# EAGLE design ESP32 (EAGLE 7.7.0)
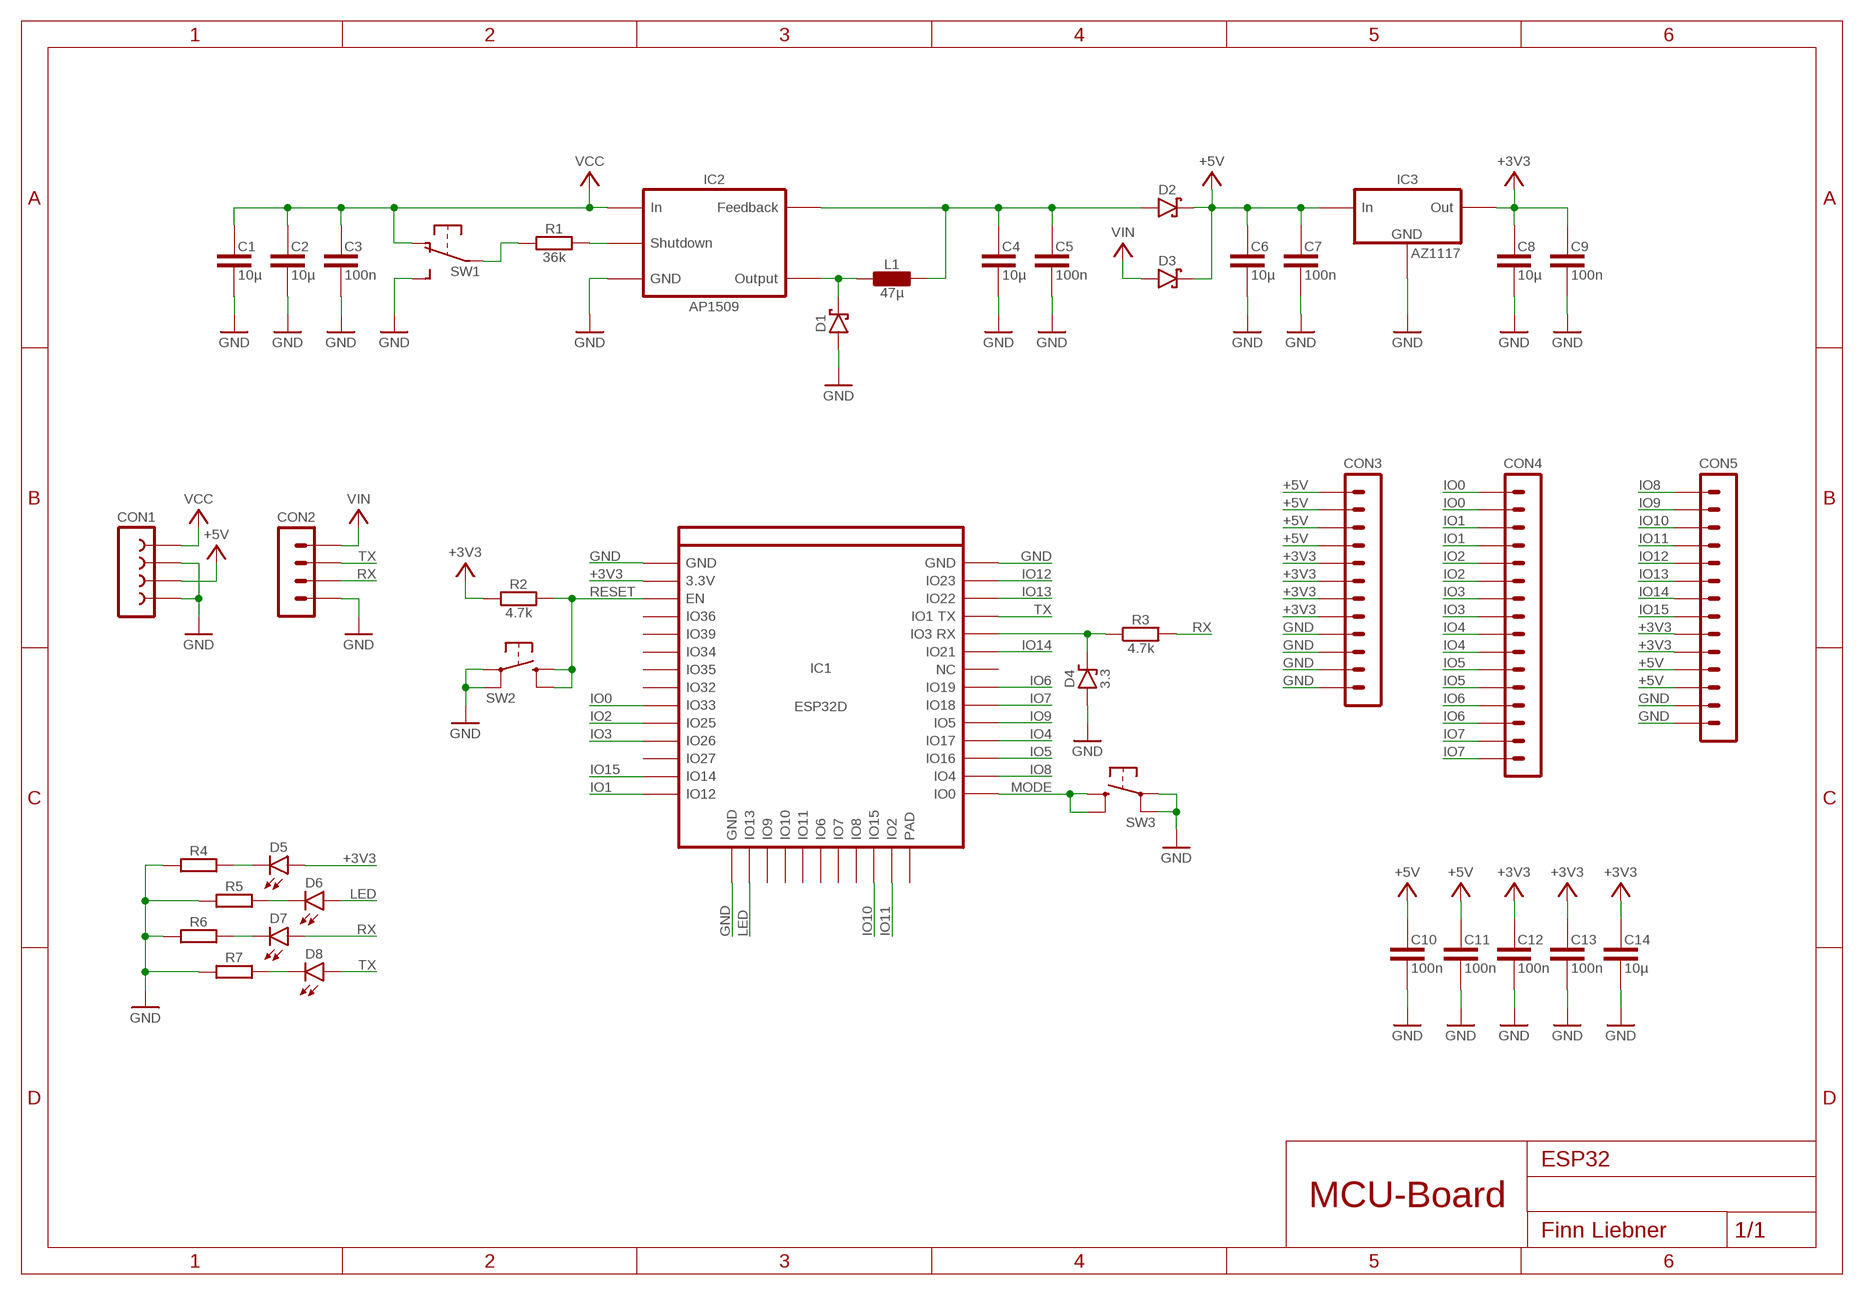
[diagram p0: schematic, sheet 1]

## Parts
C1  10µ  C1210  [C1210]
C2  10µ  C1210  [C1210]
C3  100n  C0805  [C0805]
C4  10µ  C1210  [C1210]
C5  100n  C0805  [C0805]
C6  10µ  C1210  [C1210]
C7  100n  C0805  [C0805]
C8  10µ  C1210  [C1210]
C9  100n  C0805  [C0805]
C10  100n  C0805  [C0805]
C11  100n  C0805  [C0805]
C12  100n  C0805  [C0805]
C13  100n  C0805  [C0805]
C14  10µ  C1210  [C1210]
CON1  CON-4  [CON-4]
CON2  PIN-4  [PIN-4]
D1  D-SCHOTTKY  [DO214AA-2]
D2  D-SCHOTTKY  [DO214AA-2]
D3  D-SCHOTTKY  [DO214AA-2]
D4  3.3  D-ZENER  [SOD123-2]
D5  LED  [D0805]
D6  LED  [D0805]
D7  LED  [D0805]
D8  LED  [D0805]
IC1  ESP32D  ESP32  [ESP32]
IC2  AP1509  [SO8]
IC3  AZ1117  [SOT223]
L1  47µ  L  [L6]
P1  5V  PADSMD  [PAD]
P2  5V  PADSMD  [PAD]
P3  3V  PADSMD  [PAD]
P4  3V  PADSMD  [PAD]
P5  0V  PADSMD  [PAD]
P6  0V  PADSMD  [PAD]
P7  IO0  PADSMD  [PAD]
P8  IO1  PADSMD  [PAD]
P9  IO2  PADSMD  [PAD]
P10  IO3  PADSMD  [PAD]
P11  IO4  PADSMD  [PAD]
P12  IO5  PADSMD  [PAD]
P13  IO6  PADSMD  [PAD]
P14  IO7  PADSMD  [PAD]
P15  5V  PADSMD  [PAD]
P16  5V  PADSMD  [PAD]
P17  3V  PADSMD  [PAD]
P18  3V  PADSMD  [PAD]
P19  0V  PADSMD  [PAD]
P20  0V  PADSMD  [PAD]
P21  IO0  PADSMD  [PAD]
P22  IO1  PADSMD  [PAD]
P23  IO2  PADSMD  [PAD]
P24  IO3  PADSMD  [PAD]
P25  IO4  PADSMD  [PAD]
P26  IO5  PADSMD  [PAD]
P27  IO6  PADSMD  [PAD]
P28  IO7  PADSMD  [PAD]
P30  IO8  PADTH  [PAD2]
P31  IO9  PADTH  [PAD2]
P32  IO10  PADTH  [PAD2]
P33  IO11  PADTH  [PAD2]
P34  IO12  PADTH  [PAD2]
P35  IO13  PADTH  [PAD2]
P39  5V  PADTH  [PAD2]
P40  3V  PADTH  [PAD2]
P41  0V  PADTH  [PAD2]
P42  IO14  PADTH  [PAD2]
P43  IO15  PADTH  [PAD2]
P44  3V  PADTH  [PAD2]
P45  5V  PADTH  [PAD2]
P46  0V  PADTH  [PAD2]
R1  36k  R  [R0805]
R2  4.7k  R  [R0805]
R3  4.7k  R  [R0805]
R4  R  [R0805]
R5  R  [R0805]
R6  R  [R0805]
R7  R  [R0805]
SW1  SW1  [SW1]
SW2  SW2  [SW2]
SW3  SW2  [SW2]

## Nets
+3V3: C8.1 C9.1 C12.1 C13.1 C14.1 D5.A IC1.2(3.3V) IC3.2(OUT) IC3.4(OUT) P3.1 P4.1 P17.1 P18.1 P40.P$1 P44.P$1 R2.1
+5V: C6.1 C7.1 C10.1 C11.1 CON1.3 D2.K(C) D3.K(C) IC3.3(VCC) P1.1 P2.1 P15.1 P16.1 P39.P$1 P45.P$1
GND: C1.2 C2.2 C3.2 C4.2 C5.2 C6.2 C7.2 C8.2 C9.2 C10.2 C11.2 C12.2 C13.2 C14.2 CON1.2 CON1.4 CON2.4 D1.A D4.A IC1.1(GND0) IC1.15(GND1) IC1.38(GND2) IC2.5(GND) IC2.6(GND) IC2.7(GND) IC2.8(GND) IC3.1(GND) P5.1 P6.1 P19.1 P20.1 P41.P$1 P46.P$1 R4.2 R5.2 R6.2 R7.2 SW1.3 SW1.6 SW2.1(P0) SW2.3(P1) SW3.1(P0) SW3.3(P1)
IO0: IC1.9(IO33) P7.1 P21.1
IO1: IC1.14(IO12) P8.1 P22.1
IO2: IC1.10(IO25) P9.1 P23.1
IO3: IC1.11(IO26) P10.1 P24.1
IO4: IC1.28(IO17) P11.1 P25.1
IO5: IC1.27(IO16) P12.1 P26.1
IO6: IC1.31(IO19) P13.1 P27.1
IO7: IC1.30(IO18) P14.1 P28.1
IO8: IC1.26(IO4) P30.P$1
IO9: IC1.29(IO5) P31.P$1
IO10: IC1.23(IO15) P32.P$1
IO11: IC1.24(IO2) P33.P$1
IO12: IC1.37(IO23) P34.P$1
IO13: IC1.36(IO22) P35.P$1
IO14: IC1.33(IO21) P42.P$1
IO15: IC1.13(IO14) P43.P$1
LED: D6.A IC1.16(IO13)
MODE: IC1.25(IO0) SW3.2(S0) SW3.4(S1)
N$1: IC2.4(SHDN) R1.2
N$2: D1.K(C) IC2.2(OUT) L1.1
N$3: R1.1 SW1.2(C) SW1.5(C)
N$4: C4.1 C5.1 D2.A IC2.3(FB) L1.2
N$5: D5.K R4.1
N$6: D4.K(C) IC1.34(IO3) R3.1
N$7: D6.K R5.1
N$8: D7.K R6.1
N$9: D8.K R7.1
RESET: IC1.3(EN) R2.2 SW2.2(S0) SW2.4(S1)
RX: CON2.3 D7.A R3.2
TX: CON2.2 D8.A IC1.35(IO1)
VCC: C1.1 C2.1 C3.1 CON1.1 IC2.1(IN) SW1.1 SW1.4
VIN: CON2.1 D3.A
Unconnected: IC1.4(IO36) IC1.5(IO39) IC1.6(IO34) IC1.7(IO35) IC1.8(IO32) IC1.12(IO27) IC1.17(IO9) IC1.18(IO10) IC1.19(IO11) IC1.20(IO6) IC1.21(IO7) IC1.22(IO8) IC1.32(NC) IC1.39_1(GND3) IC1.39_2(GND3) IC1.39_3(GND3) IC1.39_4(GND3) IC1.39_5(GND3) IC1.39_6(GND3) IC1.39_7(GND3) IC1.39_8(GND3) IC1.39_9(GND3)

## Notes on the sheet
- CON3 | CON4 | CON5

## Library data of the parts
C1-C14 = ESP-Board:C
CON1 = ESP-Board:CON-4
CON2 = ESP-Board:PIN-4
D1-D3 = ESP-Board:D-SCHOTTKY
D4 = ESP-Board:D-ZENER
D5-D8 = ESP-Board:LED
IC1 = ESP-Board:ESP32
IC2 = ESP-Board:AP1509
IC3 = ESP-Board:AZ1117
L1 = ESP-Board:L
P1-P28 P30-P35 P39-P46 = ESP-Board:PAD
R1-R7 = ESP-Board:R
SW1 = ESP-Board:SW1
SW2 SW3 = ESP-Board:SW2

## Board
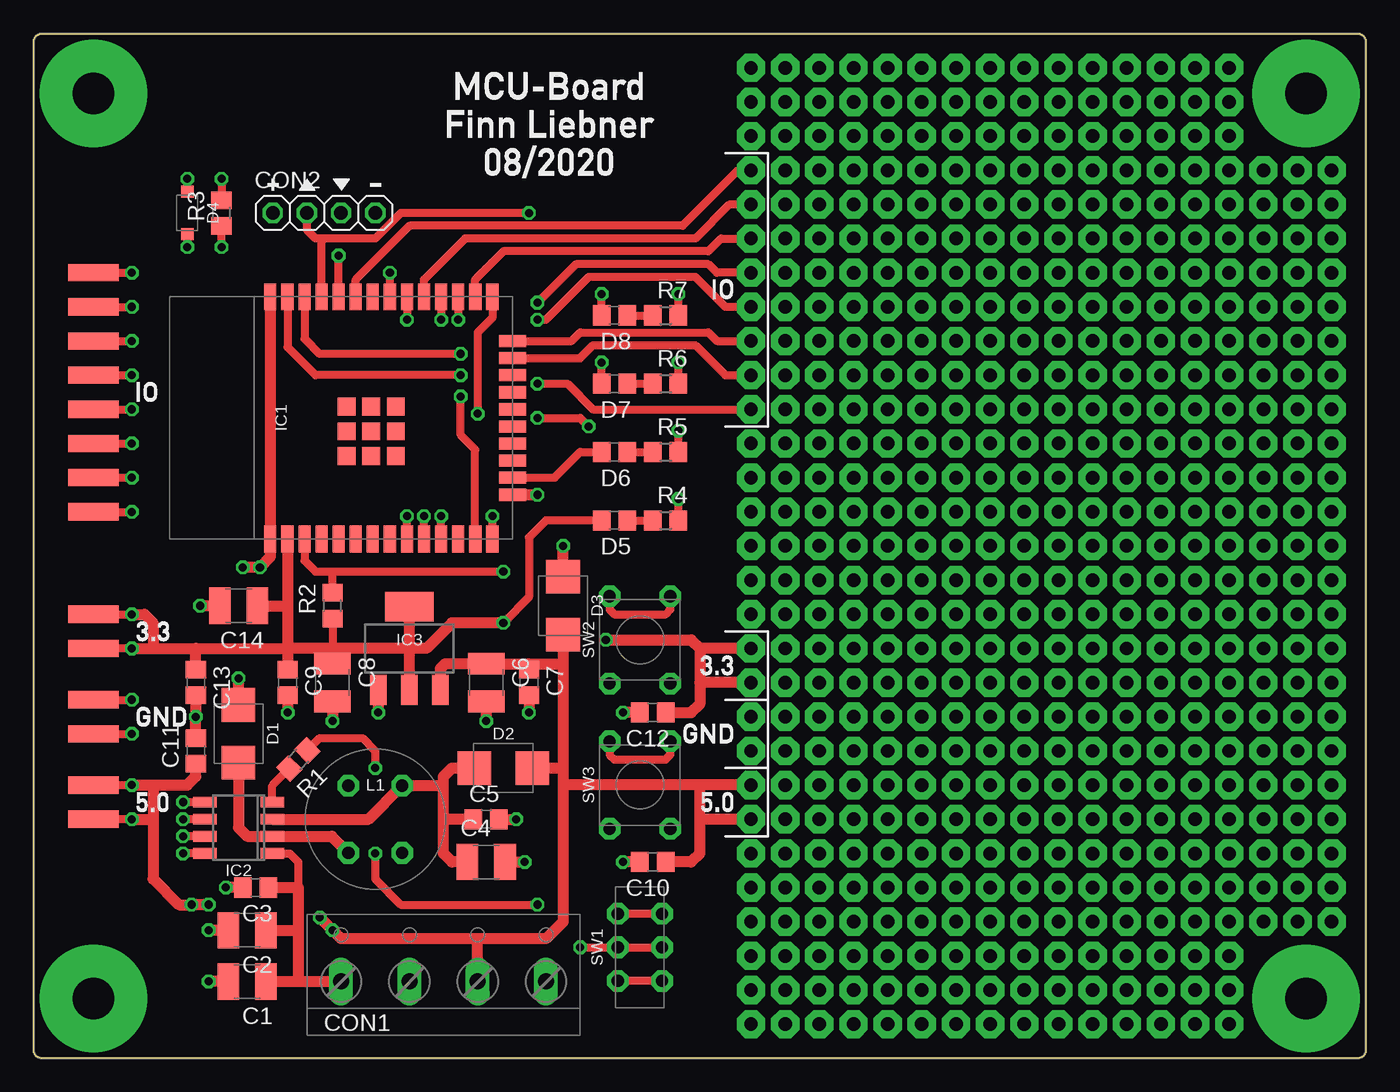
[diagram p1: board, top side]
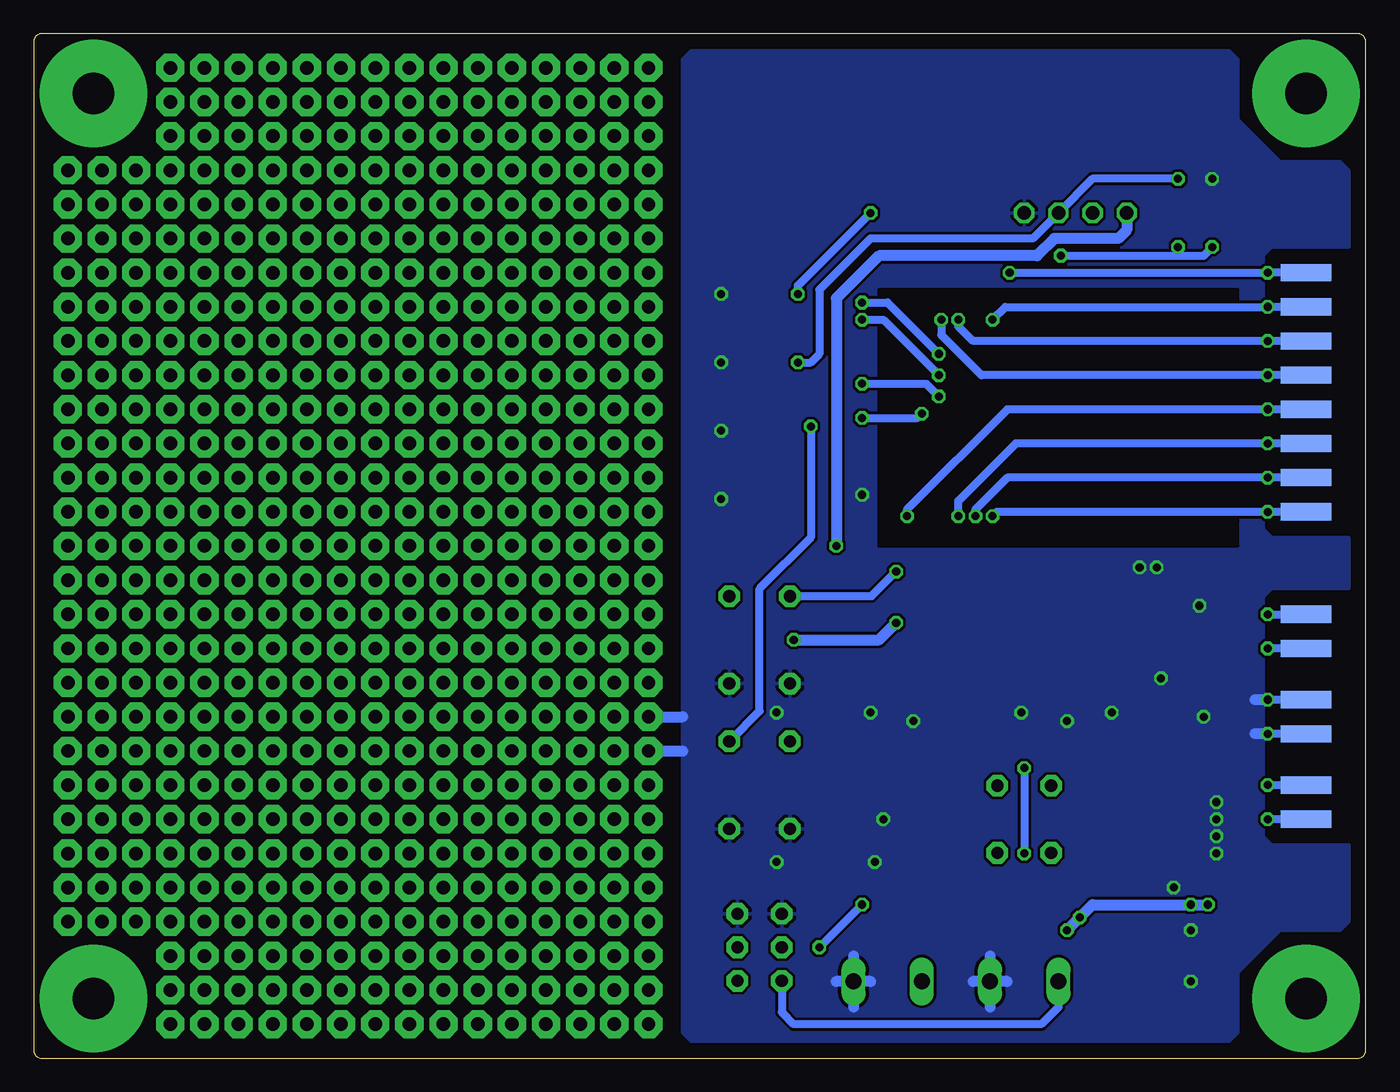
[diagram p2: board, bottom side, seen from below]

Size 99.06 x 76.2 mm. Coordinates in mm from the lower left corner, seen from the top.
Outline: 99.06,75.56 99.06,0.64 arc-90 98.42,0 0.64,0 arc-90 0,0.64 0,75.56 arc-90 0.64,76.2 98.42,76.2 arc-90 99.06,75.56
Copper layers (1*16): Top 0.035mm / dielectric 1.5mm / Bottom 0.035mm
Design rules "default": minimum track width 10mil, minimum drill 24mil, track to track 8mil, track to pad 8mil, pad to pad 8mil, via to via 8mil, smd to smd 8mil, copper to edge 40mil, drill to drill 8mil, minimum pad ring 10mil, minimum via ring 8mil, stop-mask expansion 4mil, vias tented up to drill 0mil, thermal gap 10mil

### Footprints (pad centres in the part's own frame; a part is rotated, then mirrored left to right if it is on the bottom)
C1210 = smd 1.6 x 2.7: 1 -1.4,0; 2 1.4,0
C0805 = smd 1.3 x 1.5: 1 -0.95,0; 2 0.95,0
CON-4 = drill 1.194 long: 1 -7.62,0; 2 -2.54,0; 3 2.54,0; 4 7.62,0
PIN-4 = drill 1 octagon: 1 -3.81,0; 2 -1.27,0; 3 1.27,0; 4 3.81,0
DO214AA-2 = smd 2.5 x 2.5: A -2.15,0; K 2.15,0
SOD123-2 = smd 0.9 x 0.95: A -1.575,0; K 1.575,0
D0805 = smd 1.3 x 1.5: A 0.95,0; K -0.95,0
ESP32 = smd 2 x 0.9: 1 -9,7.8; 2 -9,6.53; 3 -9,5.26; 4 -9,3.99; 5 -9,2.72; 6 -9,1.45; 7 -9,0.18; 8 -9,-1.09; 9 -9,-2.36; 10 -9,-3.63; 11 -9,-4.9; 12 -9,-6.17; 13 -9,-7.44; 14 -9,-8.71; 25 9,-8.71; 26 9,-7.44; 27 9,-6.17; 28 9,-4.9; 29 9,-3.63; 30 9,-2.36; 31 9,-1.09; 32 9,0.18; 33 9,1.45; 34 9,2.72; 35 9,3.99; 36 9,5.26; 37 9,6.53; 38 9,7.8 | smd 0.9 x 2: 15 -5.715,-10.21; 16 -4.445,-10.21; 17 -3.175,-10.21; 18 -1.905,-10.21; 19 -0.635,-10.21; 20 0.635,-10.21; 21 1.905,-10.21; 22 3.175,-10.21; 23 4.445,-10.21; 24 5.715,-10.21 | smd 1.33 x 1.33: 39_1 -2.835,2.135; 39_2 -1,2.135; 39_3 0.835,2.135; 39_4 -2.835,0.3; 39_5 -1,0.3; 39_6 0.835,0.3; 39_7 -2.835,-1.535; 39_8 -1,-1.535; 39_9 0.835,-1.535
SO8 = smd 1.75 x 0.8: 1 -2.5,1.905; 2 -2.5,0.635; 3 -2.5,-0.635; 4 -2.5,-1.905; 5 2.5,-1.905; 6 2.5,-0.635; 7 2.5,0.635; 8 2.5,1.905
SOT223 = smd 1.219 x 2.235: 1 -2.311,-3.099; 2 0,-3.099; 3 2.311,-3.099 | smd 3.6 x 2.2: 4 0,3.099
L6 = drill 0.9 pad 1.6 octagon: 1 -2,-2.5; 2 2,2.5; 3 -2,2.5; 4 2,-2.5
PAD = smd 1.27 x 3.81: 1 0,0
PAD2 = drill 1 pad 2.1 octagon: P$1 0,0
R0805 = smd 1.3 x 1.5: 1 -0.95,0; 2 0.95,0
SW1 = drill 0.9 pad 1.6 octagon: 1 -2.5,-1.65; 2 0,-1.65; 3 2.5,-1.65; 4 -2.5,1.65; 5 0,1.65; 6 2.5,1.65
SW2 = drill 0.9 pad 1.6 octagon: 1 -3.25,2.25; 2 3.25,2.25; 3 -3.25,-2.25; 4 3.25,-2.25

### Placement (x,y rotation side)
C1  15.88,5.71 180 top
C2  15.88,9.53 180 top
C3  16.51,12.7 180 top
C4  33.66,14.61 0 top
C5  33.66,17.78 0 top
C6  33.66,27.94 270 top
C7  36.83,27.94 270 top
C8  22.23,27.94 270 top
C9  18.89,27.94 270 top
C10  46.04,14.61 180 top
C11  12.06,22.86 90 top
C12  46.04,25.72 180 top
C13  12.06,27.94 270 top
C14  15.24,33.66 180 top
CON1  30.48,5.71 0 top
CON2  21.59,62.87 0 top
D1  15.24,24.13 270 top
D2  34.92,21.59 0 top
D3  39.37,33.66 270 top
D4  11.43,62.87 270 top
D5  43.18,40.01 180 top
D6  43.18,45.09 180 top
D7  43.18,50.16 180 top
D8  43.18,55.24 180 top
IC1  25.4,47.62 90 top
IC2  15.24,17.14 180 top
IC3  27.94,30.48 0 top
L1  25.4,17.78 0 top
P1  4.45,20.32 90 top
P2  4.45,17.78 90 top
P3  4.45,30.48 90 top
P4  4.45,33.02 90 top
P5  4.45,24.13 90 top
P6  4.45,26.67 90 top
P7  4.45,40.64 90 top
P8  4.45,48.26 90 top
P9  4.45,43.18 90 top
P10  4.45,45.72 90 top
P11  4.45,53.34 90 top
P12  4.45,50.8 90 top
P13  4.45,58.42 90 top
P14  4.45,55.88 90 top
P15  4.45,20.32 270 bottom
P16  4.45,17.78 270 bottom
P17  4.45,33.02 270 bottom
P18  4.45,30.48 270 bottom
P19  4.45,26.67 270 bottom
P20  4.45,24.13 270 bottom
P21  4.45,40.64 270 bottom
P22  4.45,48.26 270 bottom
P23  4.45,43.18 270 bottom
P24  4.45,45.72 270 bottom
P25  4.45,53.34 270 bottom
P26  4.45,50.8 270 bottom
P27  4.45,58.42 270 bottom
P28  4.45,55.88 270 bottom
P30  53.34,60.96 90 top
P31  53.34,63.5 90 top
P32  53.34,50.8 90 top
P33  53.34,53.34 90 top
P34  53.34,55.88 90 top
P35  53.34,58.42 90 top
P39  53.34,20.32 180 top
P40  53.34,27.94 180 top
P41  53.34,25.4 180 top
P42  53.34,66.04 270 top
P43  53.34,48.26 270 top
P44  53.34,30.48 0 top
P45  53.34,17.78 0 top
P46  53.34,22.86 0 top
R1  19.68,22.23 225 top
R2  22.23,33.66 90 top
R3  13.97,62.87 90 top
R4  46.99,40.01 0 top
R5  46.99,45.09 0 top
R6  46.99,50.16 0 top
R7  46.99,55.24 0 top
SW1  45.09,8.26 90 top
SW2  45.09,31.11 90 top
SW3  45.09,20.32 90 top

### Tracks (layer width: path | path; a pad name or v marks a point on that pad's centre or on a via)
+3V3  (via drill 0.6)
  Top 0.61: P17.1 v7.3,33.02 | v7.3,30.48 P18.1 | R2.1 22.23,30.48 | D5.A 38.1,40.01 36.83,38.73 36.83,34.29 v34.92,32.38
  Top 0.813: 27.94,30.48 22.23,30.48 | C8.1 22.23,30.48 | IC3.2 27.94,30.48 | 27.94,30.48 IC3.4 | IC1.2 18.87,33.66 | 18.87,33.66 18.87,30.48 | 18.87,30.48 18.87,28.91 C9.1 | v7.3,30.48 8.89,30.48 | 8.89,30.48 8.89,32.38 8.26,33.02 v7.3,33.02 | v34.92,32.38 31.11,32.38 29.21,30.48 27.94,30.48 | C12.1 48.9,25.72 49.53,26.35 49.53,27.94 | v42.55,31.11 48.9,31.11 49.53,30.48 | 49.53,30.48 49.53,27.94 | P44.P$1 49.53,30.48 | P40.P$1 49.53,27.94 | 22.23,30.48 18.87,30.48 | 8.89,30.48 12.06,30.48 | 12.06,30.48 18.87,30.48 | C13.1 12.06,30.48 | C14.1 18.87,33.66
  Bottom 0.61: v7.3,33.02 P17.1 | P18.1 v7.3,30.48
  Bottom 0.813: v42.55,31.11 36.2,31.11 v34.92,32.38
+5V  (via drill 0.6)
  Top 0.61: P15.1 v7.3,20.32 | v7.3,17.78 P16.1
  Top 0.813: v7.3,17.78 8.89,17.78 | C10.1 48.9,14.61 49.53,15.24 49.53,17.78 | IC3.3 30.25,28.98 30.61,29.34 C6.1 36.83,29.34 | C7.1 36.83,29.34 | CON1.3 33.02,8.89 | v21.27,10.48 v22.23,9.53 22.86,8.89 33.02,8.89 | v13.02,11.43 v11.75,11.43 10.79,11.43 8.89,13.34 8.89,17.78 | 8.89,20.32 8.89,17.78 | v7.3,20.32 8.89,20.32 | 8.89,20.32 11.43,20.32 12.06,20.95 C11.1 | D3.K 39.37,29.21 | 39.37,29.21 39.37,21.59 | 39.37,21.59 39.37,20.32 | 39.37,20.32 39.37,10.16 38.1,8.89 33.02,8.89 | D2.K 39.37,21.59 | 36.83,29.34 39.24,29.34 39.37,29.21 | P39.P$1 49.53,20.32 | 49.53,20.32 39.37,20.32 | 49.53,17.78 49.53,20.32 | P45.P$1 49.53,17.78
  Bottom 0.61: v7.3,20.32 P15.1 | P16.1 v7.3,17.78
  Bottom 0.813: v11.75,11.43 v13.02,11.43 20.32,11.43 v21.27,10.48 v22.23,9.53
GND  (via drill 0.6)
  Top 0.61: IC2.8 v11.11,15.24 | IC2.7 v11.11,16.51 | IC2.6 v11.11,17.78 | IC2.5 v11.11,19.05 | SW1.3 SW1.6 | P19.1 v7.3,26.67 | P20.1 v7.3,24.13 | R4.2 v47.94,41.59 | R5.2 v47.94,46.67 | R6.2 v47.94,51.75 | R7.2 v47.94,56.83 | D4.A v11.43,65.41
  Top 0.813: C1.2 v13.02,5.71 | C2.2 v13.02,9.53 | C3.2 v14.29,12.7 | IC3.1 v25.63,25.72 | C8.2 v22.23,25.08 | C6.2 v33.66,25.08 | C7.2 v36.83,25.72 | D1.A v15.24,28.26 | IC1.38 IC1.1 17.6,37.28 v16.83,36.51 v15.56,36.51 | IC1.15 v37.47,41.91 | C10.2 v43.81,14.61 | C12.2 v43.81,25.72 | C4.2 v36.51,14.61 | C5.2 v35.88,17.78 | C11.2 v12.06,25.4 C13.2 | C9.2 v18.89,25.72 | C14.2 v12.38,33.66
  Bottom 0.61: P19.1 v7.3,26.67 | P20.1 v7.3,24.13
  Bottom 0.813: v7.3,24.13 8.26,24.13 | v7.3,26.67 8.26,26.67 | P46.P$1 50.8,22.86 | P41.P$1 50.8,25.4 | 26.67,5.71 29.21,5.71 | 27.94,7.62 27.94,3.81 | 38.1,7.62 38.1,3.81 | 36.83,5.71 39.37,5.71
  pour Bottom: 1.91,9.53 6.35,9.53 9.53,6.35 9.53,1.91 10.16,1.27 50.16,1.27 50.8,1.91 50.8,74.3 50.16,74.93 10.16,74.93 9.53,74.3 9.53,69.85 6.35,66.67 1.91,66.67 1.27,66.04 1.27,60.33 6.99,60.33 7.62,59.69 7.62,39.37 6.99,38.73 1.27,38.73 1.27,34.92 6.99,34.92 7.62,34.29 7.62,16.51 6.99,15.88 1.27,15.88 1.27,10.16
IO0  (via drill 0.6)
  Top 0.61: IC1.9 v27.76,40.32 | P21.1 v7.3,40.64
  Bottom 0.61: v27.76,40.32 27.44,40.64 v7.3,40.64 P21.1
IO1  (via drill 0.6)
  Top 0.61: IC1.14 v34.11,40.32 | P22.1 v7.3,48.26
  Bottom 0.61: v34.11,40.32 34.11,40.82 26.67,48.26 v7.3,48.26 P22.1
IO2  (via drill 0.6)
  Top 0.61: IC1.10 v29.03,40.32 | P23.1 v7.3,43.18
  Bottom 0.61: v29.03,40.32 29.03,40.82 26.67,43.18 v7.3,43.18 P23.1
IO3  (via drill 0.6)
  Top 0.61: IC1.11 v30.3,40.32 | P24.1 v7.3,45.72
  Bottom 0.61: v30.3,40.32 30.3,41.45 26.04,45.72 v7.3,45.72 P24.1
IO4  (via drill 0.6)
  Top 0.61: P25.1 v7.3,53.34 | IC1.28 v30.3,54.93
  Bottom 0.61: v30.3,54.93 30.3,54.43 29.21,53.34 v7.3,53.34 P25.1
IO5  (via drill 0.6)
  Top 0.61: P26.1 v7.3,50.8 | IC1.27 v31.57,54.93
  Bottom 0.61: v31.57,54.93 31.57,53.8 28.57,50.8 v7.3,50.8 P26.1
IO6  (via drill 0.6)
  Top 0.61: P27.1 v7.3,58.42 | IC1.31 v26.49,58.42
  Bottom 0.61: v26.49,58.42 v7.3,58.42 P27.1
IO7  (via drill 0.6)
  Top 0.61: P28.1 v7.3,55.88 | IC1.30 v27.76,54.93
  Bottom 0.61: v27.76,54.93 26.81,55.88 v7.3,55.88 P28.1
IO8
  Top 0.61: P30.P$1 51.12,60.96 50.16,60.01 34.92,60.01 32.84,57.92 IC1.26
IO9
  Top 0.61: P31.P$1 51.75,63.5 49.21,60.96 32.07,60.96 29.03,57.92 IC1.29
IO10
  Top 0.61: IC1.23 40.64,52.07 41.59,53.02 49.21,53.02 51.44,50.8 P32.P$1
IO11
  Top 0.61: IC1.24 40.01,53.34 40.64,53.98 50.16,53.98 50.8,53.34 P33.P$1
IO12  (via drill 0.6)
  Top 0.61: P34.P$1 51.44,55.88 49.21,58.1 41.27,58.1 38.1,54.93 v37.47,54.93 | v31.75,50.8 20.95,50.8 18.87,52.88 IC1.37
  Bottom 0.61: v37.47,54.93 35.88,54.93 v31.75,50.8
IO13  (via drill 0.6)
  Top 0.61: P35.P$1 50.8,58.42 50.16,59.05 40.32,59.05 v37.47,56.2 | v31.75,52.39 21.27,52.39 20.14,53.52 IC1.36
  Bottom 0.61: v37.47,56.2 35.56,56.2 v31.75,52.39
IO14
  Top 0.61: P42.P$1 52.39,66.04 48.26,61.91 27.94,61.91 23.95,57.92 IC1.33
IO15  (via drill 0.6)
  Top 0.61: IC1.13 32.84,45.27 31.75,46.35 v31.75,49.21 | v37.47,50.16 39.69,50.16 41.59,48.26 P43.P$1
  Bottom 0.61: v37.47,50.16 32.7,50.16 v31.75,49.21
LED
  Top 0.61: IC1.16 38.73,43.18 40.64,45.09 D6.A
MODE  (via drill 0.6)
  Top 0.61: SW3.4 47.34,22.57 46.99,22.23 43.18,22.23 42.84,22.57 SW3.2 | IC1.25 34.11,55.06 33.02,53.98 v33.02,47.94 | v37.47,47.62 40.64,47.62 v41.27,46.99
  Bottom 0.61: SW3.4 45.09,25.82 45.09,34.92 41.27,38.73 v41.27,46.99 | v37.47,47.62 33.34,47.62 v33.02,47.94
N$1
  Top 0.61: R1.2 17.74,20.28 IC2.4
N$2
  Top 0.813: D1.K 15.24,17.14 15.88,16.51 IC2.2 22.17,16.51 L1.1
N$3  (via drill 0.6)
  Top 0.61: SW1.2 SW1.5 v40.64,8.26 | v25.4,21.59 25.4,22.86 24.45,23.81 21.27,23.81 R1.1 | v25.4,15.24 25.4,13.34 27.3,11.43 v37.47,11.43
  Bottom 0.61: v25.4,21.59 v25.4,15.24 | v37.47,11.43 v40.64,8.26
N$4
  Top 0.813: IC2.3 24.9,17.78 L1.2 30.44,20.28 30.48,20.32 | C4.1 31.11,14.61 30.48,15.24 30.48,17.78 | 30.48,17.78 30.48,20.32 | 30.48,20.32 30.48,20.95 31.11,21.59 D2.A | C5.1 30.48,17.78
N$5
  Top 0.61: D5.K R4.1
N$6  (via drill 0.6)
  Top 0.61: IC1.34 v22.68,59.69 | v13.97,60.33 R3.1 | D4.K v11.43,60.33
  Bottom 0.61: v22.68,59.69 13.97,59.69 | 13.97,59.69 12.06,59.69 v11.43,60.33 | v13.97,60.33 13.97,59.69
N$7
  Top 0.61: D6.K R5.1
N$8
  Top 0.61: D7.K R6.1
N$9
  Top 0.61: D8.K R7.1
N$10  (via drill 1 pad 2.1)
  other vias: 53.34,40.64
N$11  (via drill 3.1 pad 8)
  other vias: 4.45,4.45
N$12  (via drill 1 pad 2.1)
  other vias: 53.34,43.18
N$13  (via drill 1 pad 2.1)
  other vias: 53.34,45.72
N$14  (via drill 1 pad 2.1)
  other vias: 53.34,71.12
N$15  (via drill 1 pad 2.1)
  other vias: 53.34,68.58
N$16  (via drill 1 pad 2.1)
  other vias: 53.34,73.66
N$25  (via drill 1 pad 2.1)
  other vias: 53.34,12.7
N$26  (via drill 1 pad 2.1)
  other vias: 53.34,15.24
N$27  (via drill 1 pad 2.1)
  other vias: 53.34,33.02
N$28  (via drill 1 pad 2.1)
  other vias: 53.34,38.1
N$29  (via drill 1 pad 2.1)
  other vias: 53.34,35.56
N$30  (via drill 1 pad 2.1)
  other vias: 53.34,10.16
N$31  (via drill 1 pad 2.1)
  other vias: 53.34,5.08
N$32  (via drill 1 pad 2.1)
  other vias: 53.34,7.62
N$33  (via drill 1 pad 2.1)
  other vias: 53.34,2.54
N$73  (via drill 3.1 pad 8)
  other vias: 94.61,71.75
N$225  (via drill 3.1 pad 8)
  other vias: 94.61,4.45
N$249  (via drill 3.1 pad 8)
  other vias: 4.45,4.45
N$252  (via drill 3.1 pad 8)
  other vias: 4.45,71.75
N$404
  cutout Bottom: 9.53,38.1 36.2,38.1 36.2,57.15 9.53,57.15
N$1056  (via drill 1 pad 2.1)
  other vias: 58.42,12.7
N$1057  (via drill 1 pad 2.1)
  other vias: 55.88,12.7
N$1059  (via drill 1 pad 2.1)
  other vias: 58.42,15.24
N$1060  (via drill 1 pad 2.1)
  other vias: 55.88,15.24
N$1062  (via drill 1 pad 2.1)
  other vias: 58.42,17.78
N$1063  (via drill 1 pad 2.1)
  other vias: 55.88,17.78
N$1065  (via drill 1 pad 2.1)
  other vias: 58.42,20.32
N$1066  (via drill 1 pad 2.1)
  other vias: 55.88,20.32
N$1067  (via drill 1 pad 2.1)
  other vias: 58.42,22.86
N$1068  (via drill 1 pad 2.1)
  other vias: 55.88,22.86
N$1069  (via drill 1 pad 2.1)
  other vias: 58.42,25.4
N$1070  (via drill 1 pad 2.1)
  other vias: 55.88,25.4
N$1071  (via drill 1 pad 2.1)
  other vias: 58.42,27.94
N$1072  (via drill 1 pad 2.1)
  other vias: 55.88,27.94
N$1073  (via drill 1 pad 2.1)
  other vias: 58.42,30.48
N$1074  (via drill 1 pad 2.1)
  other vias: 55.88,30.48
N$1075  (via drill 1 pad 2.1)
  other vias: 58.42,33.02
N$1076  (via drill 1 pad 2.1)
  other vias: 55.88,33.02
N$1077  (via drill 1 pad 2.1)
  other vias: 58.42,35.56
N$1078  (via drill 1 pad 2.1)
  other vias: 55.88,35.56
N$1079  (via drill 1 pad 2.1)
  other vias: 58.42,38.1
N$1080  (via drill 1 pad 2.1)
  other vias: 55.88,38.1
N$1081  (via drill 1 pad 2.1)
  other vias: 58.42,40.64
N$1082  (via drill 1 pad 2.1)
  other vias: 55.88,40.64
N$1083  (via drill 1 pad 2.1)
  other vias: 58.42,43.18
N$1084  (via drill 1 pad 2.1)
  other vias: 55.88,43.18
N$1085  (via drill 1 pad 2.1)
  other vias: 58.42,45.72
N$1086  (via drill 1 pad 2.1)
  other vias: 55.88,45.72
N$1088  (via drill 1 pad 2.1)
  other vias: 58.42,48.26
N$1089  (via drill 1 pad 2.1)
  other vias: 55.88,48.26
N$1096  (via drill 1 pad 2.1)
  other vias: 58.42,50.8
N$1097  (via drill 1 pad 2.1)
  other vias: 55.88,50.8
N$1100  (via drill 1 pad 2.1)
  other vias: 58.42,53.34
N$1101  (via drill 1 pad 2.1)
  other vias: 55.88,53.34
N$1104  (via drill 1 pad 2.1)
  other vias: 58.42,55.88
N$1105  (via drill 1 pad 2.1)
  other vias: 55.88,55.88
N$1108  (via drill 1 pad 2.1)
  other vias: 58.42,58.42
N$1109  (via drill 1 pad 2.1)
  other vias: 55.88,58.42
N$1112  (via drill 1 pad 2.1)
  other vias: 58.42,66.04
N$1113  (via drill 1 pad 2.1)
  other vias: 55.88,66.04
N$1116  (via drill 1 pad 2.1)
  other vias: 58.42,68.58
N$1117  (via drill 1 pad 2.1)
  other vias: 55.88,68.58
N$1120  (via drill 1 pad 2.1)
  other vias: 58.42,71.12
N$1121  (via drill 1 pad 2.1)
  other vias: 55.88,71.12
N$1124  (via drill 1 pad 2.1)
  other vias: 58.42,73.66
N$1125  (via drill 1 pad 2.1)
  other vias: 55.88,73.66
N$1148  (via drill 1 pad 2.1)
  other vias: 58.42,60.96
N$1149  (via drill 1 pad 2.1)
  other vias: 55.88,60.96
N$1152  (via drill 1 pad 2.1)
  other vias: 58.42,63.5
N$1153  (via drill 1 pad 2.1)
  other vias: 55.88,63.5
N$1156  (via drill 1 pad 2.1)
  other vias: 55.88,10.16
N$1159  (via drill 1 pad 2.1)
  other vias: 55.88,5.08
N$1161  (via drill 1 pad 2.1)
  other vias: 55.88,7.62
N$1165  (via drill 1 pad 2.1)
  other vias: 55.88,2.54
N$1168  (via drill 1 pad 2.1)
  other vias: 58.42,10.16
N$1169  (via drill 1 pad 2.1)
  other vias: 58.42,5.08
N$1170  (via drill 1 pad 2.1)
  other vias: 58.42,7.62
N$1171  (via drill 1 pad 2.1)
  other vias: 58.42,2.54
N$1172  (via drill 1 pad 2.1)
  other vias: 60.96,66.04
N$1173  (via drill 1 pad 2.1)
  other vias: 60.96,68.58
N$1174  (via drill 1 pad 2.1)
  other vias: 60.96,71.12
N$1175  (via drill 1 pad 2.1)
  other vias: 60.96,73.66
N$1176  (via drill 1 pad 2.1)
  other vias: 60.96,10.16
N$1177  (via drill 1 pad 2.1)
  other vias: 60.96,12.7
N$1178  (via drill 1 pad 2.1)
  other vias: 60.96,15.24
N$1179  (via drill 1 pad 2.1)
  other vias: 60.96,43.18
N$1180  (via drill 1 pad 2.1)
  other vias: 60.96,45.72
N$1181  (via drill 1 pad 2.1)
  other vias: 60.96,48.26
N$1182  (via drill 1 pad 2.1)
  other vias: 60.96,50.8
N$1183  (via drill 1 pad 2.1)
  other vias: 60.96,53.34
N$1184  (via drill 1 pad 2.1)
  other vias: 60.96,55.88
N$1185  (via drill 1 pad 2.1)
  other vias: 60.96,63.5
N$1186  (via drill 1 pad 2.1)
  other vias: 60.96,17.78
N$1187  (via drill 1 pad 2.1)
  other vias: 60.96,20.32
N$1188  (via drill 1 pad 2.1)
  other vias: 60.96,22.86
N$1189  (via drill 1 pad 2.1)
  other vias: 60.96,25.4
N$1190  (via drill 1 pad 2.1)
  other vias: 60.96,27.94
N$1191  (via drill 1 pad 2.1)
  other vias: 60.96,30.48
N$1192  (via drill 1 pad 2.1)
  other vias: 60.96,33.02
N$1193  (via drill 1 pad 2.1)
  other vias: 60.96,35.56
N$1194  (via drill 1 pad 2.1)
  other vias: 60.96,38.1
N$1195  (via drill 1 pad 2.1)
  other vias: 60.96,40.64
N$1196  (via drill 1 pad 2.1)
  other vias: 60.96,58.42
N$1197  (via drill 1 pad 2.1)
  other vias: 60.96,60.96
N$1198  (via drill 1 pad 2.1)
  other vias: 60.96,2.54
N$1199  (via drill 1 pad 2.1)
  other vias: 60.96,5.08
N$1200  (via drill 1 pad 2.1)
  other vias: 60.96,7.62
N$1201  (via drill 1 pad 2.1)
  other vias: 71.12,12.7
N$1202  (via drill 1 pad 2.1)
  other vias: 68.58,12.7
N$1203  (via drill 1 pad 2.1)
  other vias: 66.04,12.7
N$1204  (via drill 1 pad 2.1)
  other vias: 71.12,15.24
N$1205  (via drill 1 pad 2.1)
  other vias: 68.58,15.24
N$1206  (via drill 1 pad 2.1)
  other vias: 66.04,15.24
N$1207  (via drill 1 pad 2.1)
  other vias: 71.12,17.78
N$1208  (via drill 1 pad 2.1)
  other vias: 68.58,17.78
N$1209  (via drill 1 pad 2.1)
  other vias: 66.04,17.78
N$1210  (via drill 1 pad 2.1)
  other vias: 71.12,20.32
N$1211  (via drill 1 pad 2.1)
  other vias: 68.58,20.32
N$1212  (via drill 1 pad 2.1)
  other vias: 71.12,22.86
N$1213  (via drill 1 pad 2.1)
  other vias: 68.58,22.86
N$1214  (via drill 1 pad 2.1)
  other vias: 71.12,25.4
N$1215  (via drill 1 pad 2.1)
  other vias: 68.58,25.4
N$1216  (via drill 1 pad 2.1)
  other vias: 71.12,27.94
N$1217  (via drill 1 pad 2.1)
  other vias: 68.58,27.94
N$1218  (via drill 1 pad 2.1)
  other vias: 71.12,30.48
N$1219  (via drill 1 pad 2.1)
  other vias: 68.58,30.48
N$1220  (via drill 1 pad 2.1)
  other vias: 71.12,33.02
N$1221  (via drill 1 pad 2.1)
  other vias: 68.58,33.02
N$1222  (via drill 1 pad 2.1)
  other vias: 71.12,35.56
N$1223  (via drill 1 pad 2.1)
  other vias: 68.58,35.56
N$1224  (via drill 1 pad 2.1)
  other vias: 71.12,38.1
N$1225  (via drill 1 pad 2.1)
  other vias: 68.58,38.1
N$1226  (via drill 1 pad 2.1)
  other vias: 71.12,40.64
N$1227  (via drill 1 pad 2.1)
  other vias: 68.58,40.64
N$1228  (via drill 1 pad 2.1)
  other vias: 71.12,43.18
N$1229  (via drill 1 pad 2.1)
  other vias: 68.58,43.18
N$1230  (via drill 1 pad 2.1)
  other vias: 71.12,45.72
N$1231  (via drill 1 pad 2.1)
  other vias: 68.58,45.72
N$1232  (via drill 1 pad 2.1)
  other vias: 66.04,45.72
N$1233  (via drill 1 pad 2.1)
  other vias: 71.12,48.26
N$1234  (via drill 1 pad 2.1)
  other vias: 68.58,48.26
N$1235  (via drill 1 pad 2.1)
  other vias: 66.04,48.26
N$1236  (via drill 1 pad 2.1)
  other vias: 63.5,12.7
N$1237  (via drill 1 pad 2.1)
  other vias: 63.5,15.24
N$1238  (via drill 1 pad 2.1)
  other vias: 63.5,17.78
N$1239  (via drill 1 pad 2.1)
  other vias: 63.5,45.72
N$1240  (via drill 1 pad 2.1)
  other vias: 63.5,48.26
N$1241  (via drill 1 pad 2.1)
  other vias: 71.12,50.8
N$1242  (via drill 1 pad 2.1)
  other vias: 68.58,50.8
N$1243  (via drill 1 pad 2.1)
  other vias: 66.04,50.8
N$1244  (via drill 1 pad 2.1)
  other vias: 63.5,50.8
N$1245  (via drill 1 pad 2.1)
  other vias: 71.12,53.34
N$1246  (via drill 1 pad 2.1)
  other vias: 68.58,53.34
N$1247  (via drill 1 pad 2.1)
  other vias: 66.04,53.34
N$1248  (via drill 1 pad 2.1)
  other vias: 63.5,53.34
N$1249  (via drill 1 pad 2.1)
  other vias: 71.12,55.88
N$1250  (via drill 1 pad 2.1)
  other vias: 68.58,55.88
N$1251  (via drill 1 pad 2.1)
  other vias: 66.04,55.88
N$1252  (via drill 1 pad 2.1)
  other vias: 63.5,55.88
N$1253  (via drill 1 pad 2.1)
  other vias: 71.12,58.42
N$1254  (via drill 1 pad 2.1)
  other vias: 68.58,58.42
N$1255  (via drill 1 pad 2.1)
  other vias: 66.04,58.42
N$1256  (via drill 1 pad 2.1)
  other vias: 63.5,58.42
N$1257  (via drill 1 pad 2.1)
  other vias: 71.12,66.04
N$1258  (via drill 1 pad 2.1)
  other vias: 68.58,66.04
N$1259  (via drill 1 pad 2.1)
  other vias: 66.04,66.04
N$1260  (via drill 1 pad 2.1)
  other vias: 63.5,66.04
N$1261  (via drill 1 pad 2.1)
  other vias: 71.12,68.58
N$1262  (via drill 1 pad 2.1)
  other vias: 68.58,68.58
N$1263  (via drill 1 pad 2.1)
  other vias: 66.04,68.58
N$1264  (via drill 1 pad 2.1)
  other vias: 63.5,68.58
N$1265  (via drill 1 pad 2.1)
  other vias: 71.12,71.12
N$1266  (via drill 1 pad 2.1)
  other vias: 68.58,71.12
N$1267  (via drill 1 pad 2.1)
  other vias: 66.04,71.12
N$1268  (via drill 1 pad 2.1)
  other vias: 63.5,71.12
N$1269  (via drill 1 pad 2.1)
  other vias: 71.12,73.66
N$1270  (via drill 1 pad 2.1)
  other vias: 68.58,73.66
N$1271  (via drill 1 pad 2.1)
  other vias: 66.04,73.66
N$1272  (via drill 1 pad 2.1)
  other vias: 63.5,73.66
N$1273  (via drill 1 pad 2.1)
  other vias: 66.04,20.32
N$1274  (via drill 1 pad 2.1)
  other vias: 63.5,20.32
N$1275  (via drill 1 pad 2.1)
  other vias: 66.04,22.86
N$1276  (via drill 1 pad 2.1)
  other vias: 63.5,22.86
N$1277  (via drill 1 pad 2.1)
  other vias: 66.04,25.4
N$1278  (via drill 1 pad 2.1)
  other vias: 63.5,25.4
N$1279  (via drill 1 pad 2.1)
  other vias: 66.04,27.94
N$1280  (via drill 1 pad 2.1)
  other vias: 63.5,27.94
N$1281  (via drill 1 pad 2.1)
  other vias: 66.04,30.48
N$1282  (via drill 1 pad 2.1)
  other vias: 63.5,30.48
N$1283  (via drill 1 pad 2.1)
  other vias: 66.04,33.02
N$1284  (via drill 1 pad 2.1)
  other vias: 63.5,33.02
N$1285  (via drill 1 pad 2.1)
  other vias: 66.04,35.56
N$1286  (via drill 1 pad 2.1)
  other vias: 63.5,35.56
N$1287  (via drill 1 pad 2.1)
  other vias: 66.04,38.1
N$1288  (via drill 1 pad 2.1)
  other vias: 63.5,38.1
N$1289  (via drill 1 pad 2.1)
  other vias: 66.04,40.64
N$1290  (via drill 1 pad 2.1)
  other vias: 63.5,40.64
N$1291  (via drill 1 pad 2.1)
  other vias: 66.04,43.18
N$1292  (via drill 1 pad 2.1)
  other vias: 63.5,43.18
N$1293  (via drill 1 pad 2.1)
  other vias: 71.12,60.96
N$1294  (via drill 1 pad 2.1)
  other vias: 68.58,60.96
N$1295  (via drill 1 pad 2.1)
  other vias: 66.04,60.96
N$1296  (via drill 1 pad 2.1)
  other vias: 63.5,60.96
N$1297  (via drill 1 pad 2.1)
  other vias: 71.12,63.5
N$1298  (via drill 1 pad 2.1)
  other vias: 68.58,63.5
N$1299  (via drill 1 pad 2.1)
  other vias: 66.04,63.5
N$1300  (via drill 1 pad 2.1)
  other vias: 63.5,63.5
N$1301  (via drill 1 pad 2.1)
  other vias: 68.58,10.16
N$1302  (via drill 1 pad 2.1)
  other vias: 66.04,10.16
N$1303  (via drill 1 pad 2.1)
  other vias: 63.5,10.16
N$1304  (via drill 1 pad 2.1)
  other vias: 68.58,5.08
N$1305  (via drill 1 pad 2.1)
  other vias: 66.04,5.08
N$1306  (via drill 1 pad 2.1)
  other vias: 68.58,7.62
N$1307  (via drill 1 pad 2.1)
  other vias: 66.04,7.62
N$1308  (via drill 1 pad 2.1)
  other vias: 63.5,5.08
N$1309  (via drill 1 pad 2.1)
  other vias: 63.5,7.62
N$1310  (via drill 1 pad 2.1)
  other vias: 68.58,2.54
N$1311  (via drill 1 pad 2.1)
  other vias: 66.04,2.54
N$1312  (via drill 1 pad 2.1)
  other vias: 63.5,2.54
N$1313  (via drill 1 pad 2.1)
  other vias: 71.12,10.16
N$1314  (via drill 1 pad 2.1)
  other vias: 71.12,5.08
N$1315  (via drill 1 pad 2.1)
  other vias: 71.12,7.62
N$1316  (via drill 1 pad 2.1)
  other vias: 71.12,2.54
N$1317  (via drill 1 pad 2.1)
  other vias: 73.66,66.04
N$1318  (via drill 1 pad 2.1)
  other vias: 73.66,68.58
N$1319  (via drill 1 pad 2.1)
  other vias: 73.66,71.12
N$1320  (via drill 1 pad 2.1)
  other vias: 73.66,73.66
N$1321  (via drill 1 pad 2.1)
  other vias: 73.66,10.16
N$1322  (via drill 1 pad 2.1)
  other vias: 73.66,12.7
N$1323  (via drill 1 pad 2.1)
  other vias: 73.66,15.24
N$1324  (via drill 1 pad 2.1)
  other vias: 73.66,43.18
N$1325  (via drill 1 pad 2.1)
  other vias: 73.66,45.72
N$1326  (via drill 1 pad 2.1)
  other vias: 73.66,48.26
N$1327  (via drill 1 pad 2.1)
  other vias: 73.66,50.8
N$1328  (via drill 1 pad 2.1)
  other vias: 73.66,53.34
N$1329  (via drill 1 pad 2.1)
  other vias: 73.66,55.88
N$1330  (via drill 1 pad 2.1)
  other vias: 73.66,63.5
N$1331  (via drill 1 pad 2.1)
  other vias: 73.66,17.78
N$1332  (via drill 1 pad 2.1)
  other vias: 73.66,20.32
N$1333  (via drill 1 pad 2.1)
  other vias: 73.66,22.86
N$1334  (via drill 1 pad 2.1)
  other vias: 73.66,25.4
N$1335  (via drill 1 pad 2.1)
  other vias: 73.66,27.94
N$1336  (via drill 1 pad 2.1)
  other vias: 73.66,30.48
N$1337  (via drill 1 pad 2.1)
  other vias: 73.66,33.02
N$1338  (via drill 1 pad 2.1)
  other vias: 73.66,35.56
N$1339  (via drill 1 pad 2.1)
  other vias: 73.66,38.1
N$1340  (via drill 1 pad 2.1)
  other vias: 73.66,40.64
N$1341  (via drill 1 pad 2.1)
  other vias: 73.66,58.42
N$1342  (via drill 1 pad 2.1)
  other vias: 73.66,60.96
N$1343  (via drill 1 pad 2.1)
  other vias: 73.66,2.54
N$1344  (via drill 1 pad 2.1)
  other vias: 73.66,5.08
N$1345  (via drill 1 pad 2.1)
  other vias: 73.66,7.62
N$1346  (via drill 1 pad 2.1)
  other vias: 83.82,12.7
N$1347  (via drill 1 pad 2.1)
  other vias: 81.28,12.7
N$1348  (via drill 1 pad 2.1)
  other vias: 78.74,12.7
N$1349  (via drill 1 pad 2.1)
  other vias: 83.82,15.24
N$1350  (via drill 1 pad 2.1)
  other vias: 81.28,15.24
N$1351  (via drill 1 pad 2.1)
  other vias: 78.74,15.24
N$1352  (via drill 1 pad 2.1)
  other vias: 83.82,17.78
N$1353  (via drill 1 pad 2.1)
  other vias: 81.28,17.78
N$1354  (via drill 1 pad 2.1)
  other vias: 78.74,17.78
N$1355  (via drill 1 pad 2.1)
  other vias: 83.82,20.32
N$1356  (via drill 1 pad 2.1)
  other vias: 81.28,20.32
N$1357  (via drill 1 pad 2.1)
  other vias: 83.82,22.86
N$1358  (via drill 1 pad 2.1)
  other vias: 81.28,22.86
N$1359  (via drill 1 pad 2.1)
  other vias: 83.82,25.4
N$1360  (via drill 1 pad 2.1)
  other vias: 81.28,25.4
N$1361  (via drill 1 pad 2.1)
  other vias: 83.82,27.94
N$1362  (via drill 1 pad 2.1)
  other vias: 81.28,27.94
N$1363  (via drill 1 pad 2.1)
  other vias: 83.82,30.48
N$1364  (via drill 1 pad 2.1)
  other vias: 81.28,30.48
N$1365  (via drill 1 pad 2.1)
  other vias: 83.82,33.02
N$1366  (via drill 1 pad 2.1)
  other vias: 81.28,33.02
N$1367  (via drill 1 pad 2.1)
  other vias: 83.82,35.56
N$1368  (via drill 1 pad 2.1)
  other vias: 81.28,35.56
N$1369  (via drill 1 pad 2.1)
  other vias: 83.82,38.1
N$1370  (via drill 1 pad 2.1)
  other vias: 81.28,38.1
N$1371  (via drill 1 pad 2.1)
  other vias: 83.82,40.64
N$1372  (via drill 1 pad 2.1)
  other vias: 81.28,40.64
N$1373  (via drill 1 pad 2.1)
  other vias: 83.82,43.18
N$1374  (via drill 1 pad 2.1)
  other vias: 81.28,43.18
N$1375  (via drill 1 pad 2.1)
  other vias: 83.82,45.72
N$1376  (via drill 1 pad 2.1)
  other vias: 81.28,45.72
N$1377  (via drill 1 pad 2.1)
  other vias: 78.74,45.72
N$1378  (via drill 1 pad 2.1)
  other vias: 83.82,48.26
N$1379  (via drill 1 pad 2.1)
  other vias: 81.28,48.26
N$1380  (via drill 1 pad 2.1)
  other vias: 78.74,48.26
N$1381  (via drill 1 pad 2.1)
  other vias: 76.2,12.7
N$1382  (via drill 1 pad 2.1)
  other vias: 76.2,15.24
N$1383  (via drill 1 pad 2.1)
  other vias: 76.2,17.78
N$1384  (via drill 1 pad 2.1)
  other vias: 76.2,45.72
N$1385  (via drill 1 pad 2.1)
  other vias: 76.2,48.26
N$1386  (via drill 1 pad 2.1)
  other vias: 83.82,50.8
N$1387  (via drill 1 pad 2.1)
  other vias: 81.28,50.8
N$1388  (via drill 1 pad 2.1)
  other vias: 78.74,50.8
N$1389  (via drill 1 pad 2.1)
  other vias: 76.2,50.8
N$1390  (via drill 1 pad 2.1)
  other vias: 83.82,53.34
N$1391  (via drill 1 pad 2.1)
  other vias: 81.28,53.34
N$1392  (via drill 1 pad 2.1)
  other vias: 78.74,53.34
N$1393  (via drill 1 pad 2.1)
  other vias: 76.2,53.34
N$1394  (via drill 1 pad 2.1)
  other vias: 83.82,55.88
N$1395  (via drill 1 pad 2.1)
  other vias: 81.28,55.88
N$1396  (via drill 1 pad 2.1)
  other vias: 78.74,55.88
N$1397  (via drill 1 pad 2.1)
  other vias: 76.2,55.88
N$1398  (via drill 1 pad 2.1)
  other vias: 83.82,58.42
N$1399  (via drill 1 pad 2.1)
  other vias: 81.28,58.42
N$1400  (via drill 1 pad 2.1)
  other vias: 78.74,58.42
N$1401  (via drill 1 pad 2.1)
  other vias: 76.2,58.42
N$1402  (via drill 1 pad 2.1)
  other vias: 83.82,66.04
N$1403  (via drill 1 pad 2.1)
  other vias: 81.28,66.04
N$1404  (via drill 1 pad 2.1)
  other vias: 78.74,66.04
N$1405  (via drill 1 pad 2.1)
  other vias: 76.2,66.04
N$1406  (via drill 1 pad 2.1)
  other vias: 83.82,68.58
N$1407  (via drill 1 pad 2.1)
  other vias: 81.28,68.58
N$1408  (via drill 1 pad 2.1)
  other vias: 78.74,68.58
N$1409  (via drill 1 pad 2.1)
  other vias: 76.2,68.58
N$1410  (via drill 1 pad 2.1)
  other vias: 83.82,71.12
N$1411  (via drill 1 pad 2.1)
  other vias: 81.28,71.12
N$1412  (via drill 1 pad 2.1)
  other vias: 78.74,71.12
N$1413  (via drill 1 pad 2.1)
  other vias: 76.2,71.12
N$1414  (via drill 1 pad 2.1)
  other vias: 83.82,73.66
N$1415  (via drill 1 pad 2.1)
  other vias: 81.28,73.66
N$1416  (via drill 1 pad 2.1)
  other vias: 78.74,73.66
N$1417  (via drill 1 pad 2.1)
  other vias: 76.2,73.66
N$1418  (via drill 1 pad 2.1)
  other vias: 78.74,20.32
N$1419  (via drill 1 pad 2.1)
  other vias: 76.2,20.32
N$1420  (via drill 1 pad 2.1)
  other vias: 78.74,22.86
N$1421  (via drill 1 pad 2.1)
  other vias: 76.2,22.86
N$1422  (via drill 1 pad 2.1)
  other vias: 78.74,25.4
N$1423  (via drill 1 pad 2.1)
  other vias: 76.2,25.4
N$1424  (via drill 1 pad 2.1)
  other vias: 78.74,27.94
N$1425  (via drill 1 pad 2.1)
  other vias: 76.2,27.94
N$1426  (via drill 1 pad 2.1)
  other vias: 78.74,30.48
N$1427  (via drill 1 pad 2.1)
  other vias: 76.2,30.48
N$1428  (via drill 1 pad 2.1)
  other vias: 78.74,33.02
N$1429  (via drill 1 pad 2.1)
  other vias: 76.2,33.02
N$1430  (via drill 1 pad 2.1)
  other vias: 78.74,35.56
N$1431  (via drill 1 pad 2.1)
  other vias: 76.2,35.56
N$1432  (via drill 1 pad 2.1)
  other vias: 78.74,38.1
N$1433  (via drill 1 pad 2.1)
  other vias: 76.2,38.1
N$1434  (via drill 1 pad 2.1)
  other vias: 78.74,40.64
N$1435  (via drill 1 pad 2.1)
  other vias: 76.2,40.64
N$1436  (via drill 1 pad 2.1)
  other vias: 78.74,43.18
N$1437  (via drill 1 pad 2.1)
  other vias: 76.2,43.18
N$1438  (via drill 1 pad 2.1)
  other vias: 83.82,60.96
N$1439  (via drill 1 pad 2.1)
  other vias: 81.28,60.96
N$1440  (via drill 1 pad 2.1)
  other vias: 78.74,60.96
N$1441  (via drill 1 pad 2.1)
  other vias: 76.2,60.96
N$1442  (via drill 1 pad 2.1)
  other vias: 83.82,63.5
N$1443  (via drill 1 pad 2.1)
  other vias: 81.28,63.5
N$1444  (via drill 1 pad 2.1)
  other vias: 78.74,63.5
N$1445  (via drill 1 pad 2.1)
  other vias: 76.2,63.5
N$1446  (via drill 1 pad 2.1)
  other vias: 81.28,10.16
N$1447  (via drill 1 pad 2.1)
  other vias: 78.74,10.16
N$1448  (via drill 1 pad 2.1)
  other vias: 76.2,10.16
N$1449  (via drill 1 pad 2.1)
  other vias: 81.28,5.08
N$1450  (via drill 1 pad 2.1)
  other vias: 78.74,5.08
N$1451  (via drill 1 pad 2.1)
  other vias: 81.28,7.62
N$1452  (via drill 1 pad 2.1)
  other vias: 78.74,7.62
N$1453  (via drill 1 pad 2.1)
  other vias: 76.2,5.08
N$1454  (via drill 1 pad 2.1)
  other vias: 76.2,7.62
N$1455  (via drill 1 pad 2.1)
  other vias: 81.28,2.54
N$1456  (via drill 1 pad 2.1)
  other vias: 78.74,2.54
N$1457  (via drill 1 pad 2.1)
  other vias: 76.2,2.54
N$1458  (via drill 1 pad 2.1)
  other vias: 83.82,10.16
N$1459  (via drill 1 pad 2.1)
  other vias: 83.82,5.08
N$1460  (via drill 1 pad 2.1)
  other vias: 83.82,7.62
N$1461  (via drill 1 pad 2.1)
  other vias: 83.82,2.54
N$1462  (via drill 1 pad 2.1)
  other vias: 88.9,12.7
N$1463  (via drill 1 pad 2.1)
  other vias: 86.36,12.7
N$1464  (via drill 1 pad 2.1)
  other vias: 88.9,15.24
N$1465  (via drill 1 pad 2.1)
  other vias: 86.36,15.24
N$1466  (via drill 1 pad 2.1)
  other vias: 88.9,17.78
N$1467  (via drill 1 pad 2.1)
  other vias: 86.36,17.78
N$1468  (via drill 1 pad 2.1)
  other vias: 88.9,20.32
N$1469  (via drill 1 pad 2.1)
  other vias: 86.36,20.32
N$1470  (via drill 1 pad 2.1)
  other vias: 88.9,22.86
N$1471  (via drill 1 pad 2.1)
  other vias: 86.36,22.86
N$1472  (via drill 1 pad 2.1)
  other vias: 88.9,25.4
N$1473  (via drill 1 pad 2.1)
  other vias: 86.36,25.4
N$1474  (via drill 1 pad 2.1)
  other vias: 88.9,27.94
N$1475  (via drill 1 pad 2.1)
  other vias: 86.36,27.94
N$1476  (via drill 1 pad 2.1)
  other vias: 88.9,30.48
N$1477  (via drill 1 pad 2.1)
  other vias: 86.36,30.48
N$1478  (via drill 1 pad 2.1)
  other vias: 88.9,33.02
N$1479  (via drill 1 pad 2.1)
  other vias: 86.36,33.02
N$1480  (via drill 1 pad 2.1)
  other vias: 88.9,35.56
N$1481  (via drill 1 pad 2.1)
  other vias: 86.36,35.56
N$1482  (via drill 1 pad 2.1)
  other vias: 88.9,38.1
N$1483  (via drill 1 pad 2.1)
  other vias: 86.36,38.1
N$1484  (via drill 1 pad 2.1)
  other vias: 88.9,40.64
N$1485  (via drill 1 pad 2.1)
  other vias: 86.36,40.64
N$1486  (via drill 1 pad 2.1)
  other vias: 88.9,43.18
N$1487  (via drill 1 pad 2.1)
  other vias: 86.36,43.18
N$1488  (via drill 1 pad 2.1)
  other vias: 88.9,45.72
N$1489  (via drill 1 pad 2.1)
  other vias: 86.36,45.72
N$1490  (via drill 1 pad 2.1)
  other vias: 88.9,48.26
N$1491  (via drill 1 pad 2.1)
  other vias: 86.36,48.26
N$1492  (via drill 1 pad 2.1)
  other vias: 88.9,50.8
N$1493  (via drill 1 pad 2.1)
  other vias: 86.36,50.8
N$1494  (via drill 1 pad 2.1)
  other vias: 88.9,53.34
N$1495  (via drill 1 pad 2.1)
  other vias: 86.36,53.34
N$1496  (via drill 1 pad 2.1)
  other vias: 88.9,55.88
N$1497  (via drill 1 pad 2.1)
  other vias: 86.36,55.88
N$1498  (via drill 1 pad 2.1)
  other vias: 88.9,58.42
N$1499  (via drill 1 pad 2.1)
  other vias: 86.36,58.42
N$1500  (via drill 1 pad 2.1)
  other vias: 88.9,66.04
N$1501  (via drill 1 pad 2.1)
  other vias: 86.36,66.04
N$1502  (via drill 1 pad 2.1)
  other vias: 88.9,68.58
N$1503  (via drill 1 pad 2.1)
  other vias: 86.36,68.58
N$1504  (via drill 1 pad 2.1)
  other vias: 88.9,71.12
N$1505  (via drill 1 pad 2.1)
  other vias: 86.36,71.12
N$1506  (via drill 1 pad 2.1)
  other vias: 88.9,73.66
N$1507  (via drill 1 pad 2.1)
  other vias: 86.36,73.66
N$1508  (via drill 1 pad 2.1)
  other vias: 88.9,60.96
N$1509  (via drill 1 pad 2.1)
  other vias: 86.36,60.96
N$1510  (via drill 1 pad 2.1)
  other vias: 88.9,63.5
N$1511  (via drill 1 pad 2.1)
  other vias: 86.36,63.5
N$1512  (via drill 1 pad 2.1)
  other vias: 86.36,10.16
N$1513  (via drill 1 pad 2.1)
  other vias: 86.36,5.08
N$1514  (via drill 1 pad 2.1)
  other vias: 86.36,7.62
N$1515  (via drill 1 pad 2.1)
  other vias: 86.36,2.54
N$1516  (via drill 1 pad 2.1)
  other vias: 88.9,10.16
N$1517  (via drill 1 pad 2.1)
  other vias: 88.9,5.08
N$1518  (via drill 1 pad 2.1)
  other vias: 88.9,7.62
N$1519  (via drill 1 pad 2.1)
  other vias: 88.9,2.54
N$1520  (via drill 1 pad 2.1)
  other vias: 91.44,12.7
N$1521  (via drill 1 pad 2.1)
  other vias: 91.44,15.24
N$1522  (via drill 1 pad 2.1)
  other vias: 91.44,17.78
N$1523  (via drill 1 pad 2.1)
  other vias: 91.44,20.32
N$1524  (via drill 1 pad 2.1)
  other vias: 91.44,22.86
N$1525  (via drill 1 pad 2.1)
  other vias: 91.44,25.4
N$1526  (via drill 1 pad 2.1)
  other vias: 91.44,27.94
N$1527  (via drill 1 pad 2.1)
  other vias: 91.44,30.48
N$1528  (via drill 1 pad 2.1)
  other vias: 91.44,33.02
N$1529  (via drill 1 pad 2.1)
  other vias: 91.44,35.56
N$1530  (via drill 1 pad 2.1)
  other vias: 91.44,38.1
N$1531  (via drill 1 pad 2.1)
  other vias: 91.44,40.64
N$1532  (via drill 1 pad 2.1)
  other vias: 91.44,43.18
N$1533  (via drill 1 pad 2.1)
  other vias: 91.44,45.72
N$1534  (via drill 1 pad 2.1)
  other vias: 91.44,48.26
N$1535  (via drill 1 pad 2.1)
  other vias: 91.44,50.8
N$1536  (via drill 1 pad 2.1)
  other vias: 91.44,53.34
N$1537  (via drill 1 pad 2.1)
  other vias: 91.44,55.88
N$1538  (via drill 1 pad 2.1)
  other vias: 91.44,58.42
N$1539  (via drill 1 pad 2.1)
  other vias: 91.44,66.04
N$1540  (via drill 1 pad 2.1)
  other vias: 91.44,60.96
N$1541  (via drill 1 pad 2.1)
  other vias: 91.44,63.5
N$1542  (via drill 1 pad 2.1)
  other vias: 91.44,10.16
N$1543  (via drill 1 pad 2.1)
  other vias: 96.52,12.7
N$1544  (via drill 1 pad 2.1)
  other vias: 93.98,12.7
N$1545  (via drill 1 pad 2.1)
  other vias: 96.52,15.24
N$1546  (via drill 1 pad 2.1)
  other vias: 93.98,15.24
N$1547  (via drill 1 pad 2.1)
  other vias: 96.52,17.78
N$1548  (via drill 1 pad 2.1)
  other vias: 93.98,17.78
N$1549  (via drill 1 pad 2.1)
  other vias: 96.52,20.32
N$1550  (via drill 1 pad 2.1)
  other vias: 93.98,20.32
N$1551  (via drill 1 pad 2.1)
  other vias: 96.52,22.86
N$1552  (via drill 1 pad 2.1)
  other vias: 93.98,22.86
N$1553  (via drill 1 pad 2.1)
  other vias: 96.52,25.4
N$1554  (via drill 1 pad 2.1)
  other vias: 93.98,25.4
N$1555  (via drill 1 pad 2.1)
  other vias: 96.52,27.94
N$1556  (via drill 1 pad 2.1)
  other vias: 93.98,27.94
N$1557  (via drill 1 pad 2.1)
  other vias: 96.52,30.48
N$1558  (via drill 1 pad 2.1)
  other vias: 93.98,30.48
N$1559  (via drill 1 pad 2.1)
  other vias: 96.52,33.02
N$1560  (via drill 1 pad 2.1)
  other vias: 93.98,33.02
N$1561  (via drill 1 pad 2.1)
  other vias: 96.52,35.56
N$1562  (via drill 1 pad 2.1)
  other vias: 93.98,35.56
N$1563  (via drill 1 pad 2.1)
  other vias: 96.52,38.1
N$1564  (via drill 1 pad 2.1)
  other vias: 93.98,38.1
N$1565  (via drill 1 pad 2.1)
  other vias: 96.52,40.64
N$1566  (via drill 1 pad 2.1)
  other vias: 93.98,40.64
N$1567  (via drill 1 pad 2.1)
  other vias: 96.52,43.18
N$1568  (via drill 1 pad 2.1)
  other vias: 93.98,43.18
N$1569  (via drill 1 pad 2.1)
  other vias: 96.52,45.72
N$1570  (via drill 1 pad 2.1)
  other vias: 93.98,45.72
N$1571  (via drill 1 pad 2.1)
  other vias: 96.52,48.26
N$1572  (via drill 1 pad 2.1)
  other vias: 93.98,48.26
N$1573  (via drill 1 pad 2.1)
  other vias: 96.52,50.8
N$1574  (via drill 1 pad 2.1)
  other vias: 93.98,50.8
N$1575  (via drill 1 pad 2.1)
  other vias: 96.52,53.34
N$1576  (via drill 1 pad 2.1)
  other vias: 93.98,53.34
N$1577  (via drill 1 pad 2.1)
  other vias: 96.52,55.88
N$1578  (via drill 1 pad 2.1)
  other vias: 93.98,55.88
N$1579  (via drill 1 pad 2.1)
  other vias: 96.52,58.42
N$1580  (via drill 1 pad 2.1)
  other vias: 93.98,58.42
N$1581  (via drill 1 pad 2.1)
  other vias: 96.52,66.04
N$1582  (via drill 1 pad 2.1)
  other vias: 93.98,66.04
N$1583  (via drill 1 pad 2.1)
  other vias: 96.52,60.96
N$1584  (via drill 1 pad 2.1)
  other vias: 93.98,60.96
N$1585  (via drill 1 pad 2.1)
  other vias: 96.52,63.5
N$1586  (via drill 1 pad 2.1)
  other vias: 93.98,63.5
N$1587  (via drill 1 pad 2.1)
  other vias: 93.98,10.16
N$1588  (via drill 1 pad 2.1)
  other vias: 96.52,10.16
RESET  (via drill 0.6)
  Top 0.61: R2.2 22.23,36.2 | IC1.3 20.14,37.01 20.95,36.2 22.23,36.2 | 22.23,36.2 v34.92,36.2 | SW2.2 42.84,33.37 43.18,33.02 46.99,33.02 47.34,33.37 SW2.4
  Bottom 0.61: SW2.2 36.76,34.37 v34.92,36.2
RX  (via drill 0.6)
  Top 0.61: D7.A v42.23,51.75 | v13.97,65.41 R3.2
  Bottom 0.61: v42.23,51.75 41.27,51.75 40.64,52.39 40.64,57.15 36.83,60.96 24.77,60.96 CON2.3 20.32,65.41 v13.97,65.41
TX  (via drill 0.6)
  Top 0.61: D8.A v42.23,56.83 | 21.59,60.96 20.95,60.96 20.32,61.59 CON2.2 | IC1.35 21.41,60.78 21.59,60.96 | v36.83,62.87 27.3,62.87 25.4,60.96 21.59,60.96
  Bottom 0.61: v42.23,56.83 v42.23,56.84 42.23,57.47 v36.83,62.87
VCC
  Top 0.61: IC2.1 19.05,15.24 19.68,14.61 19.68,12.7 | SW1.1 SW1.4 | 43.22,5.75 SW1.4 | 43.18,5.5 SW1.4
  Top 0.813: 19.68,9.53 19.68,12.7 C3.1 | 19.68,9.53 19.68,5.71 | 19.68,5.71 CON1.1 | C1.1 19.68,5.71 | C2.1 19.68,9.53
  Bottom 0.61: CON1.1 22.86,3.81 24.13,2.54 42.55,2.54 43.44,3.43 SW1.4
VIN  (via drill 0.6)
  Top 0.813: D3.A v39.37,38.1
  Bottom 0.813: CON2.1 17.78,61.59 18.41,60.96 23.18,60.96 24.45,59.69 36.2,59.69 39.37,56.52 v39.37,38.1